# Altium schematic sheet schematic.SchDoc
size A4
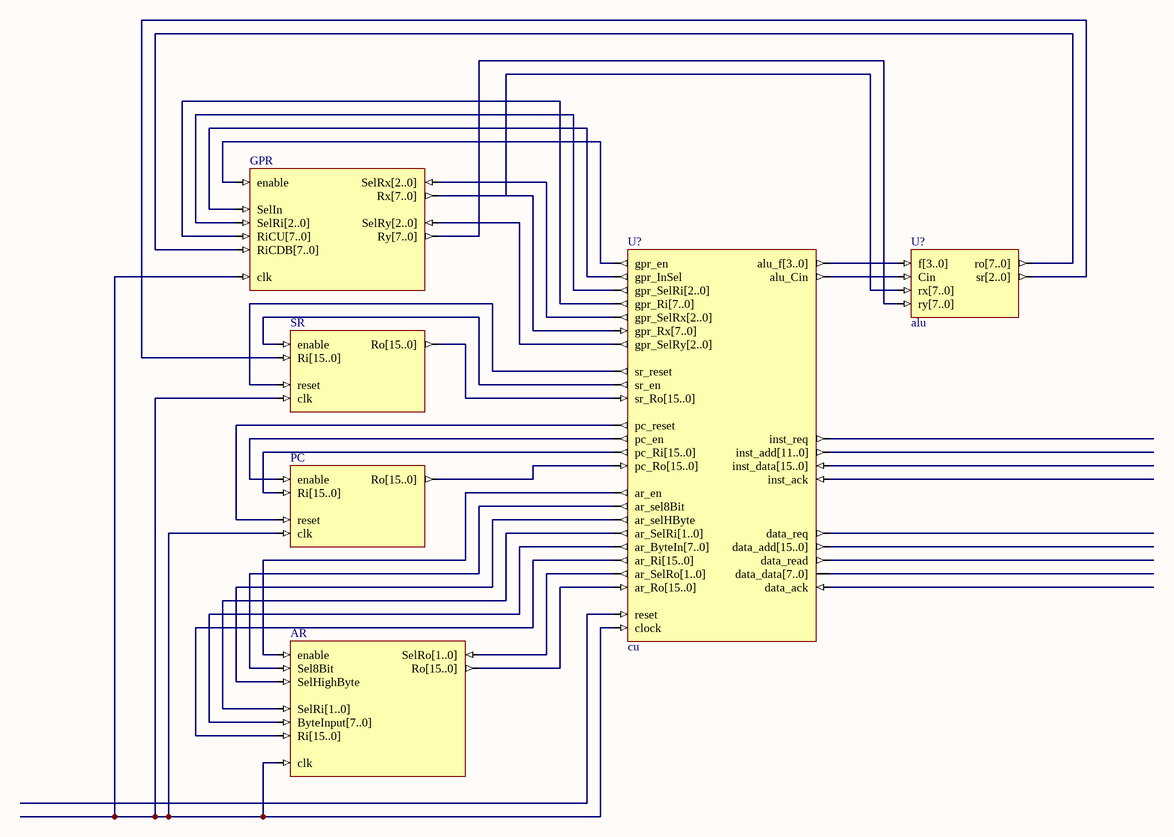
[diagram p0: schematic.SchDoc]

## Parts
(Parts that share a designator on the sheet are numbered #1, #2 ... from top to bottom, then left to right.)
AR  ar  (value not drawn)
GPR  gpr  (value not drawn)
PC  pc  (value not drawn)
SR  sr  (value not drawn)
U?#1  cu
U?#2  alu

## Nets
NetAR_ByteInput[7..0]: AR.ByteInput[7..0] U?#1.ar_ByteIn[7..0]
NetAR_clk: AR.clk GPR.clk PC.clk SR.clk U?#1.clock
NetAR_enable: AR.enable U?#1.ar_en
NetAR_Ri[15..0]: AR.Ri[15..0] U?#1.ar_Ri[15..0]
NetAR_Ro[15..0]: AR.Ro[15..0] U?#1.ar_Ro[15..0]
NetAR_Sel8Bit: AR.Sel8Bit U?#1.ar_sel8Bit
NetAR_SelHighByte: AR.SelHighByte U?#1.ar_selHByte
NetAR_SelRi[1..0]: AR.SelRi[1..0] U?#1.ar_SelRi[1..0]
NetAR_SelRo[1..0]: AR.SelRo[1..0] U?#1.ar_SelRo[1..0]
NetGPR_enable: GPR.enable U?#1.gpr_en
NetGPR_RiCDB[7..0]: GPR.RiCDB[7..0] U?#2.ro[7..0]
NetGPR_RiCU[7..0]: GPR.RiCU[7..0] U?#1.gpr_Ri[7..0]
NetGPR_Rx[7..0]: GPR.Rx[7..0] U?#1.gpr_Rx[7..0] U?#2.rx[7..0]
NetGPR_Ry[7..0]: GPR.Ry[7..0] U?#2.ry[7..0]
NetGPR_SelIn: GPR.SelIn U?#1.gpr_InSel
NetGPR_SelRi[2..0]: GPR.SelRi[2..0] U?#1.gpr_SelRi[2..0]
NetGPR_SelRx[2..0]: GPR.SelRx[2..0] U?#1.gpr_SelRx[2..0]
NetGPR_SelRy[2..0]: GPR.SelRy[2..0] U?#1.gpr_SelRy[2..0]
NetPC_enable: PC.enable U?#1.pc_en
NetPC_reset: PC.reset U?#1.pc_reset
NetPC_Ri[15..0]: PC.Ri[15..0] U?#1.pc_Ri[15..0]
NetPC_Ro[15..0]: PC.Ro[15..0] U?#1.pc_Ro[15..0]
NetSR_enable: SR.enable U?#1.sr_en
NetSR_reset: SR.reset U?#1.sr_reset
NetSR_Ri[15..0]: SR.Ri[15..0] U?#2.sr[2..0]
NetSR_Ro[15..0]: SR.Ro[15..0] U?#1.sr_Ro[15..0]
NetU?#1_alu_Cin: U?#1.alu_Cin U?#2.Cin
NetU?#1_alu_f[3..0]: U?#1.alu_f[3..0] U?#2.f[3..0]

Not connected (* = marked no-connect by the designer): U?#1 data_ack data_add[15..0] data_data[7..0] data_read data_req inst_ack inst_add[11..0] inst_data[15..0] inst_req reset